# Altium project music_amplifier.PrjPcb
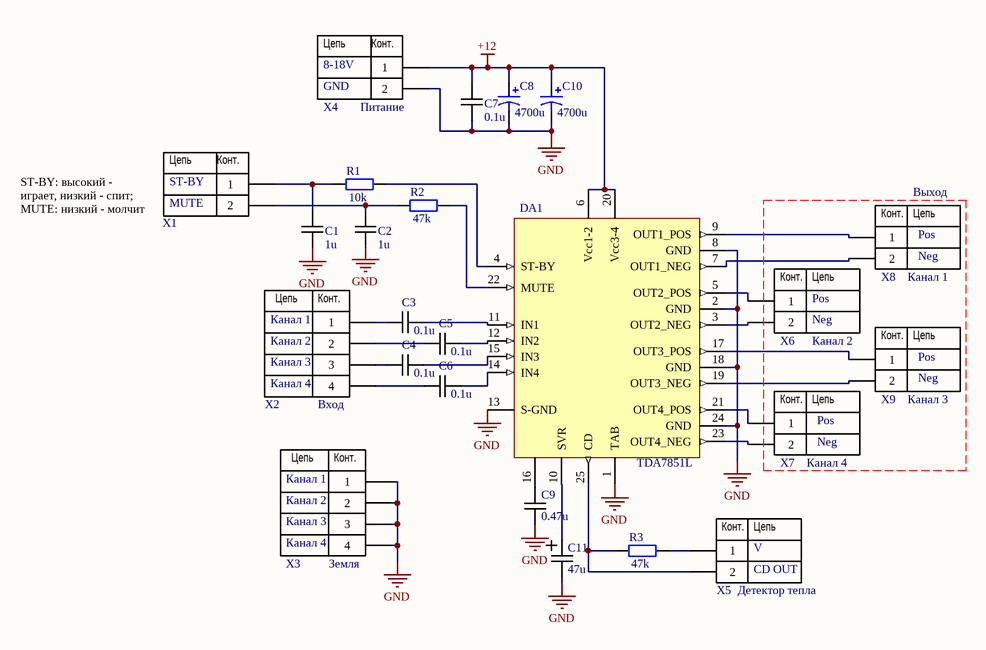
[diagram p0: Sheet1.SchDoc]
1 sheet, 24 parts. Net scope: global (net labels, ports and power ports of the same name join across sheets).
Board file: PCB1.PcbDoc

## Sheet Sheet1.SchDoc: music_amplifier
size A4; Author: piro_tex; Revision: v2

### Parts
C1  value 1u  [Capacitor SMD 0805]  (hidden comment: Cap)
C2  value 1u  [Capacitor SMD 0805]  (hidden comment: Cap)
C3  value 0.1u  [Capacitor SMD 0805]  (hidden comment: Cap)
C4  value 0.1u  [Capacitor SMD 0805]  (hidden comment: Cap)
C5  value 0.1u  [Capacitor SMD 0805]  (hidden comment: Cap)
C6  value 0.1u  [Capacitor SMD 0805]  (hidden comment: Cap)
C7  value 0.1u  [Capacitor SMD 0805]  (hidden comment: Cap)
C8  value 4700u  [RB7.6-15]  (hidden comment: Cap Pol1)
C9  value 0.47u  [Capacitor SMD 0805]  (hidden comment: Cap)
C10  value 4700u  [RB7.6-15]  (hidden comment: Cap Pol1)
C11  value 47u  [Capacitor Polar Round 5mm]  (hidden comment: Cap Polar)
DA1  TDA7851L  [TDA7851L (Flexiwatt25)]
R1  value 10k  [AXIAL-0.4]  (hidden comment: Res2)
R2  value 47k  [AXIAL-0.4]  (hidden comment: Res2)
R3  value 47k  [AXIAL-0.4]  (hidden comment: Res2)
X1  Header 2L  [Header 2]  (value not drawn)
X2  Header 4R  [Header 4]  (value not drawn)
X3  Header 4R  [Header 4]  (value not drawn)
X4  Header 2L  [Header 2]  (value not drawn)
X5  Header 2R  [Header 2]  (value not drawn)
X6  Header 2R  [Header 2]  (value not drawn)
X7  Header 2R  [Header 2]  (value not drawn)
X8  Header 2R  [Header 2]  (value not drawn)
X9  Header 2R  [Header 2]  (value not drawn)

### Nets
+12: C7.2 C8.1 C10.1 DA1.6(Vcc1-2) DA1.20(Vcc3-4) X4.1
GND: C1.2 C2.2 C7.1 C8.2 C9.1 C10.2 C11.2 DA1.1(TAB) DA1.2(GND) DA1.8(GND) DA1.13(S-GND) DA1.18(GND) DA1.24(GND) X3.1 X3.2 X3.3 X3.4 X4.2
NetC1_1: C1.1 R1.1 X1.1
NetC2_1: C2.1 R2.1 X1.2
NetC3_1: C3.1 DA1.11(IN1)
NetC3_2: C3.2 X2.1
NetC4_1: C4.1 DA1.15(IN3)
NetC4_2: C4.2 X2.3
NetC5_1: C5.1 DA1.12(IN2)
NetC5_2: C5.2 X2.2
NetC6_1: C6.1 DA1.14(IN4)
NetC6_2: C6.2 X2.4
NetC9_2: C9.2 DA1.16
NetC11_1: C11.1 DA1.10(SVR)
NetDA1_3: DA1.3(OUT2_NEG) X6.2
NetDA1_4: DA1.4(ST-BY) R1.2
NetDA1_5: DA1.5(OUT2_POS) X6.1
NetDA1_7: DA1.7(OUT1_NEG) X8.2
NetDA1_9: DA1.9(OUT1_POS) X8.1
NetDA1_17: DA1.17(OUT3_POS) X9.1
NetDA1_19: DA1.19(OUT3_NEG) X9.2
NetDA1_21: DA1.21(OUT4_POS) X7.1
NetDA1_22: DA1.22(MUTE) R2.2
NetDA1_23: DA1.23(OUT4_NEG) X7.2
NetDA1_25: DA1.25(CD) R3.1 X5.2
NetR3_2: R3.2 X5.1

### Notes on the sheet
- (near X4) 8-18V
- GND
- (near X4) Питание
- ST-BY: высокий - играет, низкий - спит; MUTE: низкий - молчит
- (near X1) ST-BY
- MUTE
- (near X8) Выход
- Pos
- (near X8) Канал 1
- (near X8) Pos
- (near X8) Neg
- (near X2) Канал 3
- (near X2) Канал 1
- (near X2) Канал 2
- Канал 2
- Neg
- (near X9) Pos
- (near X2) Канал 4
- (near X2) Вход
- (near X9) Канал 3
- (near X9) Neg
- (near X3) Канал 2
- (near X3) Канал 1
- (near X7) Канал 4
- (near X7) Neg
- (near X3) Канал 3
- (near X3) Канал 4
- (near X3) Земля
- (near X5) V
- (near X5) Детектор тепла
- (near X5) CD OUT
- Title
- Size:
- Date:
- A4
- Number:
- Time:
- Revision:
- Sheet
- of
- File:
- (in symbol Header 2L) Цепь; Конт.
- (in symbol Header 2R) Конт.; Цепь
- (in symbol Header 4R) Цепь; Конт.

### Library data of the parts
C8 C10 = Cap Pol1: Polarized Capacitor (Radial); Published: 8-Jun-2000; LatestRevisionDate: 17-Jul-2002; LatestRevisionNote: Re-released for DXP Platform.; PackageReference: RB7.6-15; Publisher: Altium Limited; PackageDescription: Polarized Capacitor (Radial); 2 Leads
C11 = Cap Polar: Voltage: 16V
R1-R3 = Res2: Resistor; Published: 8-Jun-2000; LatestRevisionDate: 17-Jul-2002; LatestRevisionNote: Re-released for DXP Platform.; PackageReference: AXIAL-0.4; Publisher: Altium Limited; PackageDescription: Axial Device, Thru-Hole; 2 Leads; 0.4 in Pin Spacing